# EAGLE schematic Tarjeta1 (EAGLE 7.6.0)
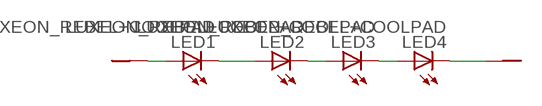
[diagram p0: schematic, sheet 1]

## Parts
LED1  LUXEON_REBEL+COOLPAD  [LUXEON_REBEL+COOLPAD]
LED2  LUXEON_REBEL+COOLPAD  [LUXEON_REBEL+COOLPAD]
LED3  LUXEON_REBEL+COOLPAD  [LUXEON_REBEL+COOLPAD]
LED4  LUXEON_REBEL+COOLPAD  [LUXEON_REBEL+COOLPAD]
U$1  POWER_PIN  [POWER_PIN]
U$2  POWER_PIN  [POWER_PIN]

## Nets
N$9: LED1.A LED1.A@1(A) U$1.P$1
N$10: LED1.C LED1.C@1(C) LED2.A LED2.A@1(A)
N$11: LED2.C LED2.C@1(C) LED3.A LED3.A@1(A)
N$12: LED3.C LED3.C@1(C) LED4.A LED4.A@1(A)
N$13: LED4.C LED4.C@1(C) U$2.P$1

## Power pins joined to a net without a drawn wire
TH: LED1.TH LED1.TH@1(TH) LED1.TH@2(TH) LED1.TH@3(TH) LED1.TH@4(TH) LED1.TH@5(TH) LED1.TH@6(TH) LED1.TH@7(TH) LED1.TH@8(TH) LED1.TH@9(TH) LED1.TH@10(TH) LED1.TH@11(TH) LED1.TH@12(TH) LED1.TH@13(TH) LED1.TH@14(TH) LED1.TH@15(TH) LED1.TH@16(TH) LED1.TH@17(TH) LED1.TH@18(TH) LED1.TH@19(TH) LED1.TH@20(TH) LED1.TH@21(TH) LED1.TH@22(TH) LED1.TH@23(TH) LED1.TH@24(TH) LED1.TH@25(TH) LED1.TH@26(TH) LED1.TH@27(TH) LED1.TH@28(TH) LED1.TH@29(TH) LED1.TH@30(TH) LED1.TH@31(TH) LED1.TH@32(TH) LED1.TH@33(TH) LED1.TH@34(TH) LED1.TH@35(TH) LED2.TH LED2.TH@1(TH) LED2.TH@2(TH) LED2.TH@3(TH) LED2.TH@4(TH) LED2.TH@5(TH) LED2.TH@6(TH) LED2.TH@7(TH) LED2.TH@8(TH) LED2.TH@9(TH) LED2.TH@10(TH) LED2.TH@11(TH) LED2.TH@12(TH) LED2.TH@13(TH) LED2.TH@14(TH) LED2.TH@15(TH) LED2.TH@16(TH) LED2.TH@17(TH) LED2.TH@18(TH) LED2.TH@19(TH) LED2.TH@20(TH) LED2.TH@21(TH) LED2.TH@22(TH) LED2.TH@23(TH) LED2.TH@24(TH) LED2.TH@25(TH) LED2.TH@26(TH) LED2.TH@27(TH) LED2.TH@28(TH) LED2.TH@29(TH) LED2.TH@30(TH) LED2.TH@31(TH) LED2.TH@32(TH) LED2.TH@33(TH) LED2.TH@34(TH) LED2.TH@35(TH) LED3.TH LED3.TH@1(TH) LED3.TH@2(TH) LED3.TH@3(TH) LED3.TH@4(TH) LED3.TH@5(TH) LED3.TH@6(TH) LED3.TH@7(TH) LED3.TH@8(TH) LED3.TH@9(TH) LED3.TH@10(TH) LED3.TH@11(TH) LED3.TH@12(TH) LED3.TH@13(TH) LED3.TH@14(TH) LED3.TH@15(TH) LED3.TH@16(TH) LED3.TH@17(TH) LED3.TH@18(TH) LED3.TH@19(TH) LED3.TH@20(TH) LED3.TH@21(TH) LED3.TH@22(TH) LED3.TH@23(TH) LED3.TH@24(TH) LED3.TH@25(TH) LED3.TH@26(TH) LED3.TH@27(TH) LED3.TH@28(TH) LED3.TH@29(TH) LED3.TH@30(TH) LED3.TH@31(TH) LED3.TH@32(TH) LED3.TH@33(TH) LED3.TH@34(TH) LED3.TH@35(TH) LED4.TH LED4.TH@1(TH) LED4.TH@2(TH) LED4.TH@3(TH) LED4.TH@4(TH) LED4.TH@5(TH) LED4.TH@6(TH) LED4.TH@7(TH) LED4.TH@8(TH) LED4.TH@9(TH) LED4.TH@10(TH) LED4.TH@11(TH) LED4.TH@12(TH) LED4.TH@13(TH) LED4.TH@14(TH) LED4.TH@15(TH) LED4.TH@16(TH) LED4.TH@17(TH) LED4.TH@18(TH) LED4.TH@19(TH) LED4.TH@20(TH) LED4.TH@21(TH) LED4.TH@22(TH) LED4.TH@23(TH) LED4.TH@24(TH) LED4.TH@25(TH) LED4.TH@26(TH) LED4.TH@27(TH) LED4.TH@28(TH) LED4.TH@29(TH) LED4.TH@30(TH) LED4.TH@31(TH) LED4.TH@32(TH) LED4.TH@33(TH) LED4.TH@34(TH) LED4.TH@35(TH)

## Library data of the parts
LED1-LED4 = led-lumiled:LUXEON_REBEL+COOLPAD: LUXEON REBEL LED with cooling pads Display Layer Refence in Board for more information Stop and Cream Mask defined by Luxeon Rebel Footprint _customer.dxf; OC_FARNELL: unknown; OC_NEWARK: unknown
U$1 U$2 = ijrobotics:POWER_PIN: POWER PIN